# Altium project HNS-ZB206B-0B.PrjPCB
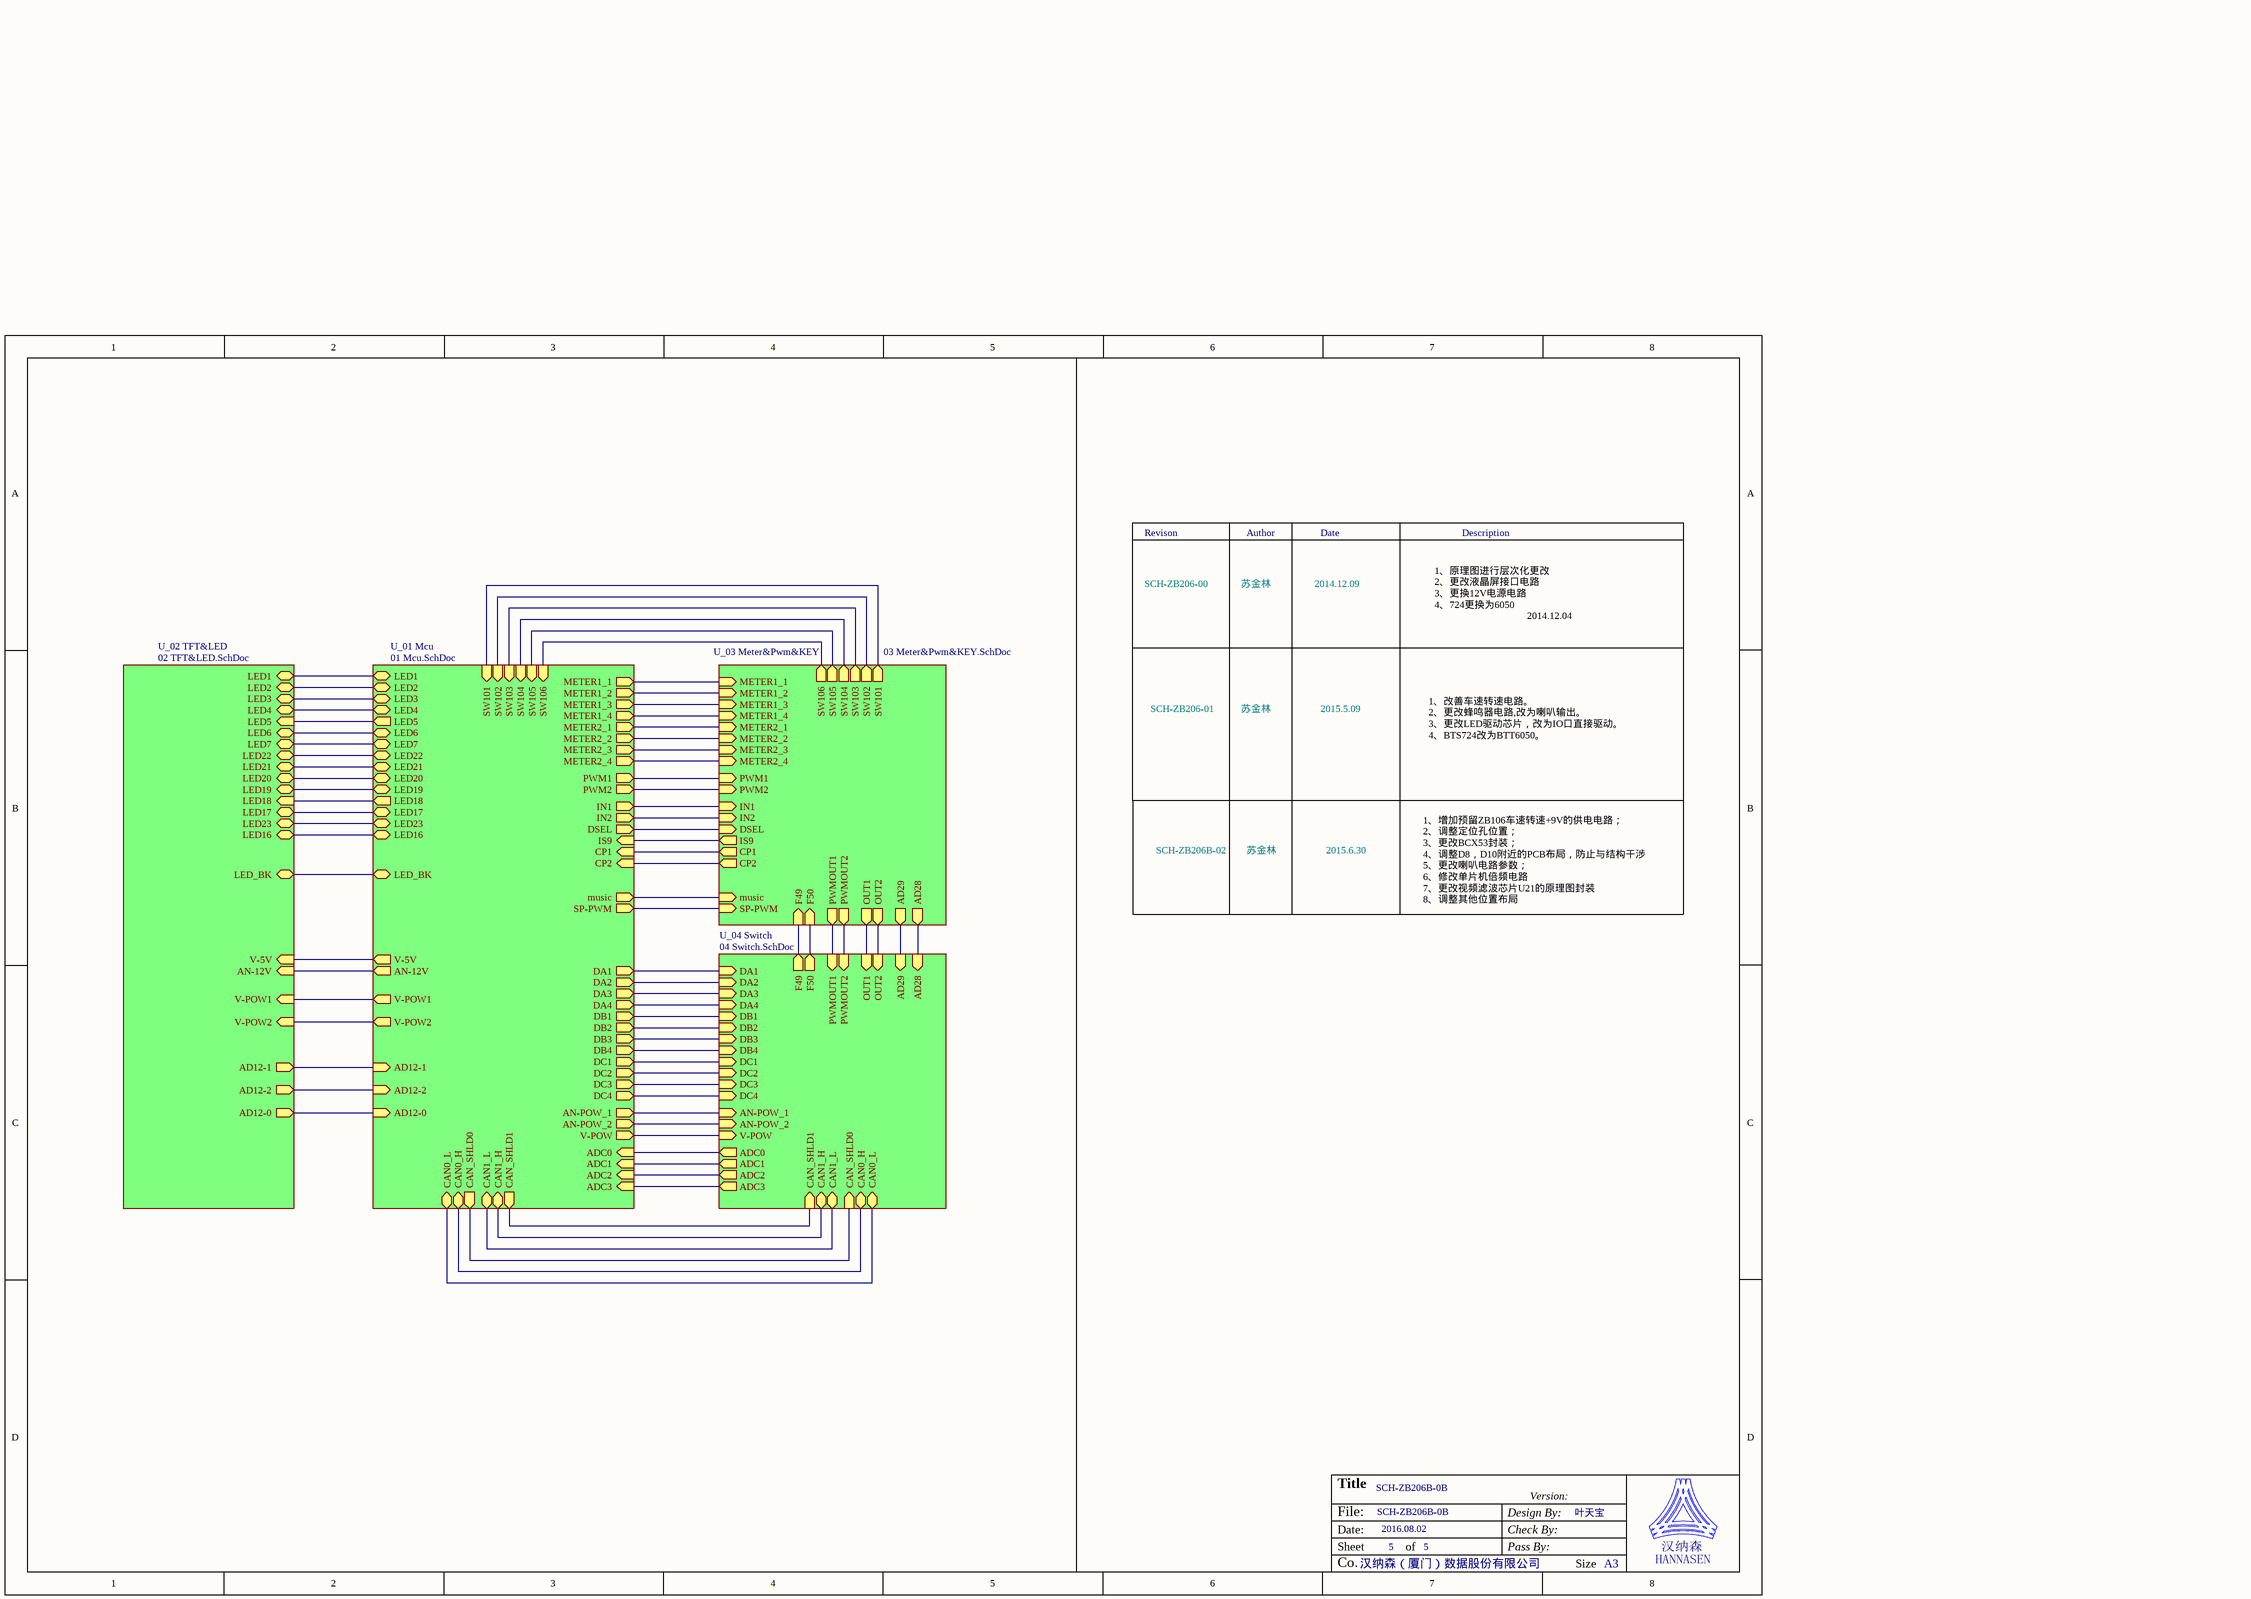
[diagram p0: SCH-ZB206B-0B.SchDoc]
DrawnBy: 叶天宝
3 sheets, 285 parts. Net scope: hierarchical (ports join the sheet entries above them; power ports are global).
Board file: PCB-ZB206B-0B.PcbDoc
Sheets:
  SCH-ZB206B-0B.SchDoc
    U_04 Switch = 04 Switch.SchDoc
    U_01 Mcu = 01 Mcu.SchDoc

## Sheet SCH-ZB206B-0B.SchDoc: Title
size A3; PageSetup: Record=PageOptions|CenterHorizontal=True|CenterVertical=True|PrintScale=1.00|XCorrection=1.00|YCorrection=1.00|PrintKind=0|BorderSize=5000000|LeftOffset=0|BottomOffset=0|Orientation=2|PaperLength=1000|PaperWidth=1000|Scale=100|PaperSource=7|PrintQuality=-4|MediaType=1|DitherType=10|PaperKind=A4|PrintScaleMode=1; ApprovedBy: Approve; CheckedBy: Check; DrawnBy: 叶天宝; Organization: HNS; DocumentNumber: 5; SheetNumber: 5; SheetTotal: 5

### Sub-sheets
U_01 Mcu = 01 Mcu.SchDoc: METER1_1 (out), METER1_2 (out), METER1_3 (out), METER1_4 (out), METER2_1 (out), METER2_2 (out), METER2_3 (out), METER2_4 (out), SW101 (in), SW102 (in), SW103 (in), SW104 (in), SW105 (in), SW106 (in), CP1 (in), CP2 (in), DA1 (out), DA2 (out), DA3 (out), DA4 (out), DB1 (out), DB2 (out), DB3 (out), DB4 (out), DC1 (out), DC2 (out), DC3 (out), DC4 (out), ADC0 (in), ADC1 (in), ADC2 (in), ADC3 (in), PWM1 (out), PWM2 (out), V-POW (out), AN-POW_1 (out), V-5V (out), IN1 (out), IN2 (out), V-POW1 (out), AN-12V (out), LED6 (bidir), LED7 (bidir), LED1 (bidir), LED2 (bidir), LED3 (bidir), LED4 (bidir), LED5 (out), CAN_SHLD1 (out), CAN1_H (bidir), CAN1_L (bidir), CAN_SHLD0 (out), CAN0_H (bidir), CAN0_L (bidir), V-POW2 (out), AD12-1 (in), AD12-2 (in), IS9 (in), DSEL (out), AN-POW_2 (out), music (out), SP-PWM (out), LED17 (bidir), LED22 (bidir), LED21 (bidir), LED20 (bidir), LED19 (bidir), LED18 (out), LED_BK (bidir), LED23 (bidir), LED16 (bidir), AD12-0 (in)
U_02 TFT&LED = 02 TFT&LED.SchDoc (file not in this document): V-5V (in), AD12-0 (out), AN-12V (in), LED2 (bidir), LED1 (bidir), LED3 (bidir), LED4 (bidir), LED5 (in), LED6 (bidir), LED7 (bidir), V-POW1 (in), AD12-1 (out), AD12-2 (out), V-POW2 (in), LED21 (bidir), LED22 (bidir), LED20 (bidir), LED19 (bidir), LED18 (in), LED17 (bidir), LED_BK (bidir), LED23 (bidir), LED16 (bidir)
U_03 Meter&Pwm&KEY = 03 Meter&Pwm&KEY.SchDoc (file not in this document): PWM1 (in), PWMOUT1 (out), PWM2 (in), PWMOUT2 (out), METER1_1 (in), METER1_2 (in), METER1_3 (in), METER1_4 (in), METER2_1 (in), METER2_2 (in), METER2_3 (in), METER2_4 (in), CP1 (out), CP2 (out), F50 (in), F49 (in), OUT1 (out), OUT2 (out), IN1 (in), IN2 (in), SW101 (out), SW102 (out), SW103 (out), SW104 (out), SW105 (out), SW106 (out), DSEL (in), IS9 (out), SP-PWM (in), music (in), AD29 (out), AD28 (out)
U_04 Switch = 04 Switch.SchDoc: F49 (out), F50 (out), PWMOUT1 (in), PWMOUT2 (in), CAN0_H (bidir), CAN_SHLD0 (in), CAN0_L (bidir), CAN1_L (bidir), CAN1_H (bidir), CAN_SHLD1 (in), ADC0 (out), ADC1 (out), ADC2 (out), ADC3 (out), DA1 (in), DA2 (in), DA3 (in), DA4 (in), DB1 (in), DB2 (in), DB3 (in), DB4 (in), DC1 (in), DC2 (in), DC3 (in), DC4 (in), AN-POW_1 (in), OUT1 (in), OUT2 (in), V-POW (in), AD29 (in), AN-POW_2 (in), AD28 (in)

### Nets
AD12-0: sheet U_01 Mcu/AD12-0, sheet U_02 TFT&LED/AD12-0
AD12-1: sheet U_01 Mcu/AD12-1, sheet U_02 TFT&LED/AD12-1
AD12-2: sheet U_01 Mcu/AD12-2, sheet U_02 TFT&LED/AD12-2
AD28: sheet U_04 Switch/AD28, sheet U_03 Meter&Pwm&KEY/AD28
AD29: sheet U_04 Switch/AD29, sheet U_03 Meter&Pwm&KEY/AD29
ADC0: sheet U_04 Switch/ADC0, sheet U_01 Mcu/ADC0
ADC1: sheet U_04 Switch/ADC1, sheet U_01 Mcu/ADC1
ADC2: sheet U_04 Switch/ADC2, sheet U_01 Mcu/ADC2
ADC3: sheet U_04 Switch/ADC3, sheet U_01 Mcu/ADC3
AN-12V: sheet U_01 Mcu/AN-12V, sheet U_02 TFT&LED/AN-12V
AN-POW_1: sheet U_04 Switch/AN-POW_1, sheet U_01 Mcu/AN-POW_1
AN-POW_2: sheet U_04 Switch/AN-POW_2, sheet U_01 Mcu/AN-POW_2
CAN0_H: sheet U_04 Switch/CAN0_H, sheet U_01 Mcu/CAN0_H
CAN0_L: sheet U_04 Switch/CAN0_L, sheet U_01 Mcu/CAN0_L
CAN1_H: sheet U_04 Switch/CAN1_H, sheet U_01 Mcu/CAN1_H
CAN1_L: sheet U_04 Switch/CAN1_L, sheet U_01 Mcu/CAN1_L
CAN_SHLD0: sheet U_04 Switch/CAN_SHLD0, sheet U_01 Mcu/CAN_SHLD0
CAN_SHLD1: sheet U_04 Switch/CAN_SHLD1, sheet U_01 Mcu/CAN_SHLD1
CP1: sheet U_01 Mcu/CP1, sheet U_03 Meter&Pwm&KEY/CP1
CP2: sheet U_01 Mcu/CP2, sheet U_03 Meter&Pwm&KEY/CP2
DA1: sheet U_04 Switch/DA1, sheet U_01 Mcu/DA1
DA2: sheet U_04 Switch/DA2, sheet U_01 Mcu/DA2
DA3: sheet U_04 Switch/DA3, sheet U_01 Mcu/DA3
DA4: sheet U_04 Switch/DA4, sheet U_01 Mcu/DA4
DB1: sheet U_04 Switch/DB1, sheet U_01 Mcu/DB1
DB2: sheet U_04 Switch/DB2, sheet U_01 Mcu/DB2
DB3: sheet U_04 Switch/DB3, sheet U_01 Mcu/DB3
DB4: sheet U_04 Switch/DB4, sheet U_01 Mcu/DB4
DC1: sheet U_04 Switch/DC1, sheet U_01 Mcu/DC1
DC2: sheet U_04 Switch/DC2, sheet U_01 Mcu/DC2
DC3: sheet U_04 Switch/DC3, sheet U_01 Mcu/DC3
DC4: sheet U_04 Switch/DC4, sheet U_01 Mcu/DC4
DSEL: sheet U_01 Mcu/DSEL, sheet U_03 Meter&Pwm&KEY/DSEL
F49: sheet U_04 Switch/F49, sheet U_03 Meter&Pwm&KEY/F49
F50: sheet U_04 Switch/F50, sheet U_03 Meter&Pwm&KEY/F50
IN1: sheet U_01 Mcu/IN1, sheet U_03 Meter&Pwm&KEY/IN1
IN2: sheet U_01 Mcu/IN2, sheet U_03 Meter&Pwm&KEY/IN2
IS9: sheet U_01 Mcu/IS9, sheet U_03 Meter&Pwm&KEY/IS9
LED1: sheet U_01 Mcu/LED1, sheet U_02 TFT&LED/LED1
LED2: sheet U_01 Mcu/LED2, sheet U_02 TFT&LED/LED2
LED3: sheet U_01 Mcu/LED3, sheet U_02 TFT&LED/LED3
LED4: sheet U_01 Mcu/LED4, sheet U_02 TFT&LED/LED4
LED5: sheet U_01 Mcu/LED5, sheet U_02 TFT&LED/LED5
LED6: sheet U_01 Mcu/LED6, sheet U_02 TFT&LED/LED6
LED7: sheet U_01 Mcu/LED7, sheet U_02 TFT&LED/LED7
LED16: sheet U_01 Mcu/LED16, sheet U_02 TFT&LED/LED16
LED17: sheet U_01 Mcu/LED17, sheet U_02 TFT&LED/LED17
LED18: sheet U_01 Mcu/LED18, sheet U_02 TFT&LED/LED18
LED19: sheet U_01 Mcu/LED19, sheet U_02 TFT&LED/LED19
LED20: sheet U_01 Mcu/LED20, sheet U_02 TFT&LED/LED20
LED21: sheet U_01 Mcu/LED21, sheet U_02 TFT&LED/LED21
LED22: sheet U_01 Mcu/LED22, sheet U_02 TFT&LED/LED22
LED23: sheet U_01 Mcu/LED23, sheet U_02 TFT&LED/LED23
LED_BK: sheet U_01 Mcu/LED_BK, sheet U_02 TFT&LED/LED_BK
METER1_1: sheet U_01 Mcu/METER1_1, sheet U_03 Meter&Pwm&KEY/METER1_1
METER1_2: sheet U_01 Mcu/METER1_2, sheet U_03 Meter&Pwm&KEY/METER1_2
METER1_3: sheet U_01 Mcu/METER1_3, sheet U_03 Meter&Pwm&KEY/METER1_3
METER1_4: sheet U_01 Mcu/METER1_4, sheet U_03 Meter&Pwm&KEY/METER1_4
METER2_1: sheet U_01 Mcu/METER2_1, sheet U_03 Meter&Pwm&KEY/METER2_1
METER2_2: sheet U_01 Mcu/METER2_2, sheet U_03 Meter&Pwm&KEY/METER2_2
METER2_3: sheet U_01 Mcu/METER2_3, sheet U_03 Meter&Pwm&KEY/METER2_3
METER2_4: sheet U_01 Mcu/METER2_4, sheet U_03 Meter&Pwm&KEY/METER2_4
music: sheet U_01 Mcu/music, sheet U_03 Meter&Pwm&KEY/music
OUT1: sheet U_04 Switch/OUT1, sheet U_03 Meter&Pwm&KEY/OUT1
OUT2: sheet U_04 Switch/OUT2, sheet U_03 Meter&Pwm&KEY/OUT2
PWM1: sheet U_01 Mcu/PWM1, sheet U_03 Meter&Pwm&KEY/PWM1
PWM2: sheet U_01 Mcu/PWM2, sheet U_03 Meter&Pwm&KEY/PWM2
PWMOUT1: sheet U_04 Switch/PWMOUT1, sheet U_03 Meter&Pwm&KEY/PWMOUT1
PWMOUT2: sheet U_04 Switch/PWMOUT2, sheet U_03 Meter&Pwm&KEY/PWMOUT2
SP-PWM: sheet U_01 Mcu/SP-PWM, sheet U_03 Meter&Pwm&KEY/SP-PWM
SW101: sheet U_01 Mcu/SW101, sheet U_03 Meter&Pwm&KEY/SW101
SW102: sheet U_01 Mcu/SW102, sheet U_03 Meter&Pwm&KEY/SW102
SW103: sheet U_01 Mcu/SW103, sheet U_03 Meter&Pwm&KEY/SW103
SW104: sheet U_01 Mcu/SW104, sheet U_03 Meter&Pwm&KEY/SW104
SW105: sheet U_01 Mcu/SW105, sheet U_03 Meter&Pwm&KEY/SW105
SW106: sheet U_01 Mcu/SW106, sheet U_03 Meter&Pwm&KEY/SW106
V-5V: sheet U_01 Mcu/V-5V, sheet U_02 TFT&LED/V-5V
V-POW: sheet U_04 Switch/V-POW, sheet U_01 Mcu/V-POW
V-POW1: sheet U_01 Mcu/V-POW1, sheet U_02 TFT&LED/V-POW1
V-POW2: sheet U_01 Mcu/V-POW2, sheet U_02 TFT&LED/V-POW2

### Notes on the sheet
- Revison
- Author
- Date
- Description
- SCH-ZB206-00
- 苏金林
- 2014.12.09
- 1、原理图进行层次化更改
  2、更改液晶屏接口电路
  3、更换12V电源电路
  4、724更换为6050
  2014.12.04
- SCH-ZB206-01
- 2015.5.09
- 1、改善车速转速电路。
  2、更改蜂鸣器电路,改为喇叭输出。
  3、更改LED驱动芯片，改为IO口直接驱动。
  4、BTS724改为BTT6050。
- SCH-ZB206B-02
- 2015.6.30
- 1、增加预留ZB106车速转速+9V的供电电路；
  2、调整定位孔位置；
  3、更改BCX53封装；
  4、调整D8，D10附近的PCB布局，防止与结构干涉
  5、更改喇叭电路参数；
  6、修改单片机倍频电路
  7、更改视频滤波芯片U21的原理图封装
  8、调整其他位置布局
- SCH-ZB206B-0B
- 2016.08.02
- 5
- 叶天宝
- Title
- Version:
- File:
- Date:
- Sheet
- of
- Design By:
- Check By:
- Pass By:
- Co.
- 汉纳森（厦门）数据股份有限公司
- Size
- A3

## Sheet 04 Switch.SchDoc: Title
size A3; ApprovedBy: Approve; CheckedBy: Check; DrawnBy: 叶天宝; Organization: HNS; DocumentNumber: 4; SheetNumber: 4; SheetTotal: 5
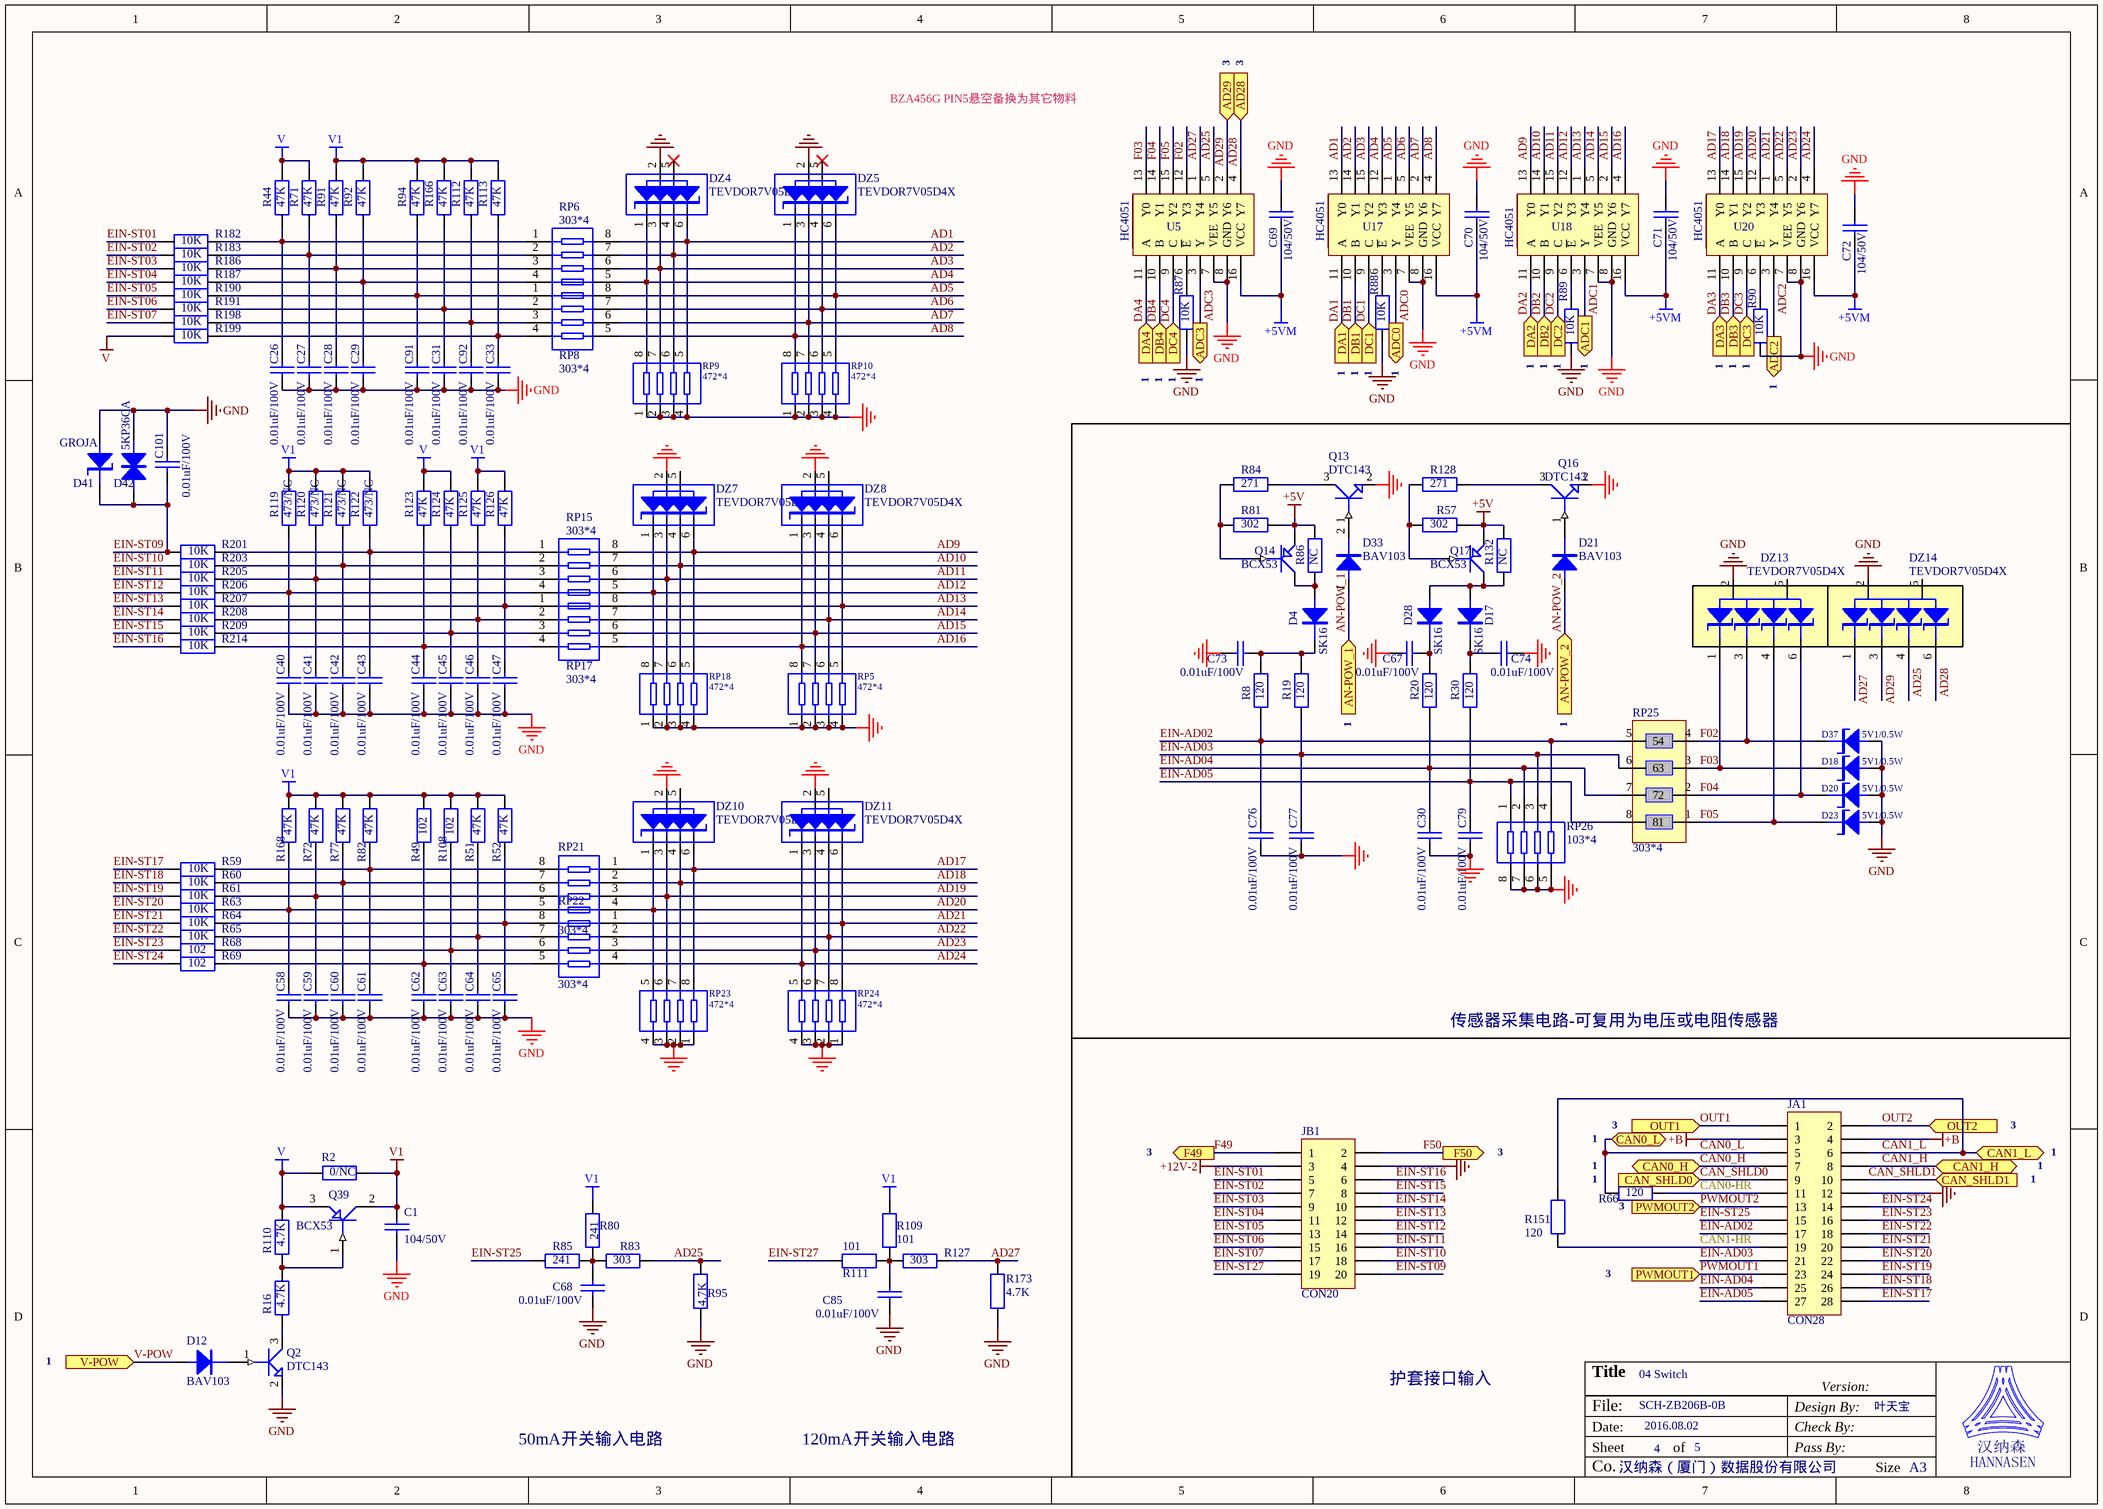
[diagram p1: 04 Switch.SchDoc]

### Parts
C1  104/50V  [CR0805]
C26  0.01uF/100V  [CR0805]
C27  0.01uF/100V  [CR0805]
C28  0.01uF/100V  [CR0805]
C29  0.01uF/100V  [CR0805]
C30  0.01uF/100V  [CR0805]
C31  0.01uF/100V  [CR0805]
C33  0.01uF/100V  [CR0805]
C40  0.01uF/100V  [CR0805]
C41  0.01uF/100V  [CR0805]
C42  0.01uF/100V  [CR0805]
C43  0.01uF/100V  [CR0805]
C44  0.01uF/100V  [CR0805]
C45  0.01uF/100V  [CR0805]
C46  0.01uF/100V  [CR0805]
C47  0.01uF/100V  [CR0805]
C58  0.01uF/100V  [CR0805]
C59  0.01uF/100V  [CR0805]
C60  0.01uF/100V  [CR0805]
C61  0.01uF/100V  [CR0805]
C62  0.01uF/100V  [CR0805]
C63  0.01uF/100V  [CR0805]
C64  0.01uF/100V  [CR0805]
C65  0.01uF/100V  [CR0805]
C67  0.01uF/100V  [CR0805]
C68  0.01uF/100V  [CR0805]
C69  104/50V  [CR0805]
C70  104/50V  [CR0805]
C71  104/50V  [CR0805]
C72  104/50V  [CR0805]
C73  0.01uF/100V  [CR0805]
C74  0.01uF/100V  [CR0805]
C76  0.01uF/100V  [CR0805]
C77  0.01uF/100V  [CR0805]
C79  0.01uF/100V  [CR0805]
C85  0.01uF/100V  [CR0805]
C91  0.01uF/100V  [CR0805]
C92  0.01uF/100V  [CR0805]
C101  0.01uF/100V  [CR0805]
D4  SK16  [SMA]
D12  BAV103  [SOD-80C]
D17  SK16  [SMA]
D18  5V1/0.5W  [SOD-80C]
D20  5V1/0.5W  [SOD-80C]
D21  BAV103  [SOD-80C]
D23  5V1/0.5W  [SOD-80C]
D28  SK16  [SMA]
D33  BAV103  [SOD-80C]
D37  5V1/0.5W  [SOD-80C]
D41  GROJA  [SMA]
D42  5KP36CA  [SMB-D]
DZ4  TEVDOR7V05D4X  [SOT-457]
DZ5  TEVDOR7V05D4X  [SOT-457]
DZ7  TEVDOR7V05D4X  [SOT-457]
DZ8  TEVDOR7V05D4X  [SOT-457]
DZ10  TEVDOR7V05D4X  [SOT-457]
DZ11  TEVDOR7V05D4X  [SOT-457]
DZ13  TEVDOR7V05D4X  [SOT-457]
DZ14  TEVDOR7V05D4X  [SOT-457]
JA1  CON28  [AMP DIP28]
JB1  CON20  [AMP DIP20]
Q2  DTC143  [SOT23]
Q13  DTC143  [SOT23]
Q14  BCX53  [SOT89]
Q16  DTC143  [SOT23]
Q17  BCX53  [SOT89]
Q39  BCX53  [SOT89]
R2  0/NC  [CR1206]
R8  120  [CR1206]
R16  4.7K  [CR1206]
R19  120  [CR1206]
R20  120  [CR1206]
R30  120  [CR1206]
R44  47K  [CR0805]
R49  102  [CR2010]
R51  47K  [CR0805]
R52  47K  [CR0805]
R57  302  [CR0805]
R59  10K  [CR1206]
R60  10K  [CR1206]
R61  10K  [CR1206]
R63  10K  [CR1206]
R64  10K  [CR1206]
R65  10K  [CR1206]
R66  120  [CR0805]
R68  102  [CR2010]
R69  102  [CR2010]
R71  47K  [CR0805]
R72  47K  [CR0805]
R77  47K  [CR0805]
R80  241  [R-3W]
R81  302  [CR0805]
R82  47K  [CR0805]
R83  303  [CR0805]
R84  271  [CR0805]
R85  241  [R-3W]
R86  NC  [CR1206]
R87  10K  [CR0805]
R88  10K  [CR0805]
R89  10K  [CR0805]
R90  10K  [CR0805]
R91  47K  [CR0805]
R92  47K  [CR0805]
R94  47K  [CR0805]
R95  4.7K  [CR0805]
R108  102  [CR2010]
R109  101  [R-3W]
R110  4.7K  [CR0805]
R111  101  [R-3W]
R112  47K  [CR0805]
R113  47K  [CR0805]
R119  473/NC  [CR0805]
R120  473/NC  [CR0805]
R121  473/NC  [CR0805]
R122  473/NC  [CR0805]
R123  47K  [CR0805]
R124  47K  [CR0805]
R125  47K  [CR0805]
R126  47K  [CR0805]
R127  303  [CR0805]
R128  271  [CR0805]
R132  NC  [CR1206]
R151  120  [CR0805]
R166  47K  [CR0805]
R168  47K  [CR0805]
R173  4.7K  [CR0805]
R182  10K  [CR1206]
R183  10K  [CR1206]
R186  10K  [CR1206]
R187  10K  [CR1206]
R190  10K  [CR1206]
R191  10K  [CR1206]
R198  10K  [CR1206]
R199  10K  [CR1206]
R201  10K  [CR1206]
R203  10K  [CR1206]
R205  10K  [CR1206]
R206  10K  [CR1206]
R207  10K  [CR1206]
R208  10K  [CR1206]
R209  10K  [CR1206]
R214  10K  [CR1206]
RP5  472*4  [R4]
RP6  303*4  [R4]
RP8  303*4  [R4]
RP9  472*4  [R4]
RP10  472*4  [R4]
RP15  303*4  [R4]
RP17  303*4  [R4]
RP18  472*4  [R4]
RP21  303*4  [R4]
RP22  303*4  [R4]
RP23  472*4  [R4]
RP24  472*4  [R4]
RP25  303*4  [R4]
RP26  103*4  [R4]
U5  HC4051  [SO-16]
U17  HC4051  [SO-16]
U18  HC4051  [SO-16]
U20  HC4051  [SO-16]

### Ports
AD28 (in), AD29 (in), ADC0 (out), ADC1 (out), ADC2 (out), ADC3 (out), AN-POW_1 (in), AN-POW_2 (in), CAN0_H (bidir), CAN0_L (bidir), CAN1_H (bidir), CAN1_L (bidir), CAN_SHLD0 (in), CAN_SHLD1 (in), DA1 (in), DA2 (in), DA3 (in), DA4 (in), DB1 (in), DB2 (in), DB3 (in), DB4 (in), DC1 (in), DC2 (in), DC3 (in), DC4 (in), F49 (out), F50 (out), OUT1 (in), OUT2 (in), PWMOUT1 (in), PWMOUT2 (in), V-POW (in)

### Nets
+5V: Q14.3(E) Q17.3(E) R57.1 R81.1 R86.1 R132.1
+5VM: C69.2 C70.2 C71.2 C72.2 U5.16(VCC) U17.16(VCC) U18.16(VCC) U20.16(VCC)
+12V-2: JB1.3
+B: JA1.3 JA1.4
GND: C1.2 C26.2 C27.2 C28.2 C29.2 C30.2 C31.2 C33.2 C40.2 C41.2 C42.2 C43.2 C44.2 C45.2 C46.2 C47.2 C58.2 C59.2 C60.2 C61.2 C62.2 C63.2 C64.2 C65.2 C67.1 C68.2 C69.1 C70.1 C71.1 C72.1 C73.1 C74.2 C76.2 C77.2 C79.2 C85.2 C91.2 C92.2 C101.1 D18.1(A) D20.1(A) D23.1(A) D37.1(A) D41.1(A) D42.1 DZ4.2 DZ5.2 DZ7.2 DZ8.2 DZ10.2 DZ11.2 DZ13.2 DZ14.2 JA1.12 JB1.4 Q2.2(gnd) Q13.2(gnd) Q16.2(gnd) R87.2 R88.2 R89.2 R90.2 R95.1 R173.1 RP5.1 RP5.2 RP5.3 RP5.4 RP9.1 RP9.2 RP9.3 RP9.4 RP10.1 RP10.2 RP10.3 RP10.4 RP18.1 RP18.2 RP18.3 RP18.4 RP23.1 RP23.2 RP23.3 RP23.4 RP24.1 RP24.2 RP24.3 RP24.4 RP26.5 RP26.6 RP26.7 RP26.8 U5.7(VEE) U5.8(GND) U17.7(VEE) U17.8(GND) U18.7(VEE) U18.8(GND) U20.7(VEE) U20.8(GND)
V: Q39.3(C) R2.1 R44.2 R71.2 R110.2 R123.2 R124.2 R199.1
V1: C1.1 Q39.2(E) R2.2 R49.2 R51.2 R52.2 R72.2 R77.2 R80.2 R82.2 R91.2 R92.2 R94.2 R108.2 R109.2 R112.2 R113.2 R119.2 R120.2 R121.2 R122.2 R125.2 R126.2 R166.2 R168.2
AD1: DZ4.6 RP6.8 RP9.5 U17.13(Y0)
AD2: DZ4.4 RP6.7 RP9.6 U17.14(Y1)
AD3: DZ4.3 RP6.6 RP9.7 U17.15(Y2)
AD4: DZ4.1 RP6.5 RP9.8 U17.12(Y3)
AD5: DZ5.6 RP8.8 RP10.5 U17.1(Y4)
AD6: DZ5.4 RP8.7 RP10.6 U17.5(Y5)
AD7: DZ5.3 RP8.6 RP10.7 U17.2(Y6)
AD8: DZ5.1 RP8.5 RP10.8 U17.4(Y7)
AD9: DZ7.6 RP15.8 RP18.5 U18.13(Y0)
AD10: DZ7.4 RP15.7 RP18.6 U18.14(Y1)
AD11: DZ7.3 RP15.6 RP18.7 U18.15(Y2)
AD12: DZ7.1 RP15.5 RP18.8 U18.12(Y3)
AD13: DZ8.6 RP5.5 RP17.8 U18.1(Y4)
AD14: DZ8.4 RP5.6 RP17.7 U18.5(Y5)
AD15: DZ8.3 RP5.7 RP17.6 U18.2(Y6)
AD16: DZ8.1 RP5.8 RP17.5 U18.4(Y7)
AD17: DZ10.6 RP21.1 RP23.8 U20.13(Y0)
AD18: DZ10.4 RP21.2 RP23.7 U20.14(Y1)
AD19: DZ10.3 RP21.3 RP23.6 U20.15(Y2)
AD20: DZ10.1 RP21.4 RP23.5 U20.12(Y3)
AD21: DZ11.6 RP22.1 RP24.8 U20.1(Y4)
AD22: DZ11.4 RP22.2 RP24.7 U20.5(Y5)
AD23: DZ11.3 RP22.3 RP24.6 U20.2(Y6)
AD24: DZ11.1 RP22.4 RP24.5 U20.4(Y7)
AD25: DZ14.4 R83.2 R95.2 U5.5(Y5)
AD27: DZ14.1 R127.2 R173.2 U5.1(Y4)
AD28: DZ14.6 U5.4(Y7) ; port AD28
AD29: DZ14.3 U5.2(Y6) ; port AD29
ADC0: U17.3(Y) ; port ADC0
ADC1: U18.3(Y) ; port ADC1
ADC2: U20.3(Y) ; port ADC2
ADC3: U5.3(Y) ; port ADC3
AN-POW_1: D33.1(A) ; port AN-POW_1
AN-POW_2: D21.1(A) ; port AN-POW_2
CAN0-HR: JA1.11 R66.2
CAN0_H: JA1.7 ; port CAN0_H
CAN0_L: JA1.5 R66.1 ; port CAN0_L
CAN1-HR: JA1.19 R151.1
CAN1_H: JA1.8 ; port CAN1_H
CAN1_L: JA1.6 R151.2 ; port CAN1_L
CAN_SHLD0: JA1.9 ; port CAN_SHLD0
CAN_SHLD1: JA1.10 ; port CAN_SHLD1
DA1: U17.11(A) ; port DA1
DA2: U18.11(A) ; port DA2
DA3: U20.11(A) ; port DA3
DA4: U5.11(A) ; port DA4
DB1: U17.10(B) ; port DB1
DB2: U18.10(B) ; port DB2
DB3: U20.10(B) ; port DB3
DB4: U5.10(B) ; port DB4
DC1: U17.9(C) ; port DC1
DC2: U18.9(C) ; port DC2
DC3: U20.9(C) ; port DC3
DC4: U5.9(C) ; port DC4
EIN-AD02: C76.1 JA1.17 R8.2 RP25.5 RP26.4
EIN-AD03: C77.1 JA1.21 R19.2 RP25.6 RP26.3
EIN-AD04: C30.1 JA1.25 R20.2 RP25.7 RP26.2
EIN-AD05: C79.1 JA1.27 R30.2 RP25.8 RP26.1
EIN-ST01: JB1.5 R182.1
EIN-ST02: JB1.7 R183.1
EIN-ST03: JB1.9 R186.1
EIN-ST04: JB1.11 R187.1
EIN-ST05: JB1.13 R190.1
EIN-ST06: JB1.15 R191.1
EIN-ST07: JB1.17 R198.1
EIN-ST09: C101.2 D41.2(K) D42.2 JB1.20 R201.1
EIN-ST10: JB1.18 R203.1
EIN-ST11: JB1.16 R205.1
EIN-ST12: JB1.14 R206.1
EIN-ST13: JB1.12 R207.1
EIN-ST14: JB1.10 R208.1
EIN-ST15: JB1.8 R209.1
EIN-ST16: JB1.6 R214.1
EIN-ST17: JA1.28 R59.1
EIN-ST18: JA1.26 R60.1
EIN-ST19: JA1.24 R61.1
EIN-ST20: JA1.22 R63.1
EIN-ST21: JA1.20 R64.1
EIN-ST22: JA1.18 R65.1
EIN-ST23: JA1.16 R68.1
EIN-ST24: JA1.14 R69.1
EIN-ST25: JA1.15 R85.1
EIN-ST27: JB1.19 R111.1
F02: D37.2(K) DZ13.3 RP25.4 U5.12(Y3)
F03: D18.2(K) DZ13.1 RP25.3 U5.13(Y0)
F04: D20.2(K) DZ13.6 RP25.2 U5.14(Y1)
F05: D23.2(K) DZ13.4 RP25.1 U5.15(Y2)
F49: JB1.1 ; port F49
F50: JB1.2 ; port F50
OUT1: JA1.1 ; port OUT1
OUT2: JA1.2 ; port OUT2
PWMOUT1: JA1.23 ; port PWMOUT1
PWMOUT2: JA1.13 ; port PWMOUT2
V-POW: D12.1(A) ; port V-POW
NetC26_1: C26.1 R44.1 R182.2 RP6.1
NetC27_1: C27.1 R71.1 R183.2 RP6.2
NetC28_1: C28.1 R91.1 R186.2 RP6.3
NetC29_1: C29.1 R92.1 R187.2 RP6.4
NetC31_1: C31.1 R166.1 R191.2 RP8.2
NetC33_1: C33.1 R113.1 R199.2 RP8.4
NetC40_1: C40.1 R119.1 R206.2 RP15.4
NetC41_1: C41.1 R120.1 R205.2 RP15.3
NetC42_1: C42.1 R121.1 R203.2 RP15.2
NetC43_1: C43.1 R122.1 R201.2 RP15.1
NetC44_1: C44.1 R123.1 R214.2 RP17.4
NetC45_1: C45.1 R124.1 R209.2 RP17.3
NetC46_1: C46.1 R125.1 R208.2 RP17.2
NetC47_1: C47.1 R126.1 R207.2 RP17.1
NetC58_1: C58.1 R63.2 R168.1 RP21.5
NetC59_1: C59.1 R61.2 R72.1 RP21.6
NetC60_1: C60.1 R60.2 R77.1 RP21.7
NetC61_1: C61.1 R59.2 R82.1 RP21.8
NetC62_1: C62.1 R49.1 R69.2 RP22.5
NetC63_1: C63.1 R68.2 R108.1 RP22.6
NetC64_1: C64.1 R51.1 R65.2 RP22.7
NetC65_1: C65.1 R52.1 R64.2 RP22.8
NetC67_2: C67.2 D28.2(K) R20.1
NetC68_1: C68.1 R80.1 R83.1 R85.2
NetC73_2: C73.2 D4.2(K) R8.1 R19.1
NetC74_1: C74.1 D17.2(K) R30.1
NetC85_1: C85.1 R109.1 R111.2 R127.1
NetC91_1: C91.1 R94.1 R190.2 RP8.1
NetC92_1: C92.1 R112.1 R198.2 RP8.3
NetD4_1: D4.1(A) Q14.2(C) R86.2
NetD12_2: D12.2(K) Q2.1(in)
NetD17_1: D17.1(A) D28.1(A) Q17.2(C) R132.2
NetD21_2: D21.2(K) Q16.1(in)
NetD33_2: D33.2(K) Q13.1(in)
NetQ2_3: Q2.3(out) R16.1
NetQ13_3: Q13.3(out) R84.2
NetQ14_1: Q14.1(B) R81.2 R84.1
NetQ16_3: Q16.3(out) R128.1
NetQ17_1: Q17.1(B) R57.2 R128.2
NetQ39_1: Q39.1(B) R16.2 R110.1
NetR87_1: R87.1 U5.6(~{E})
NetR88_1: R88.1 U17.6(~{E})
NetR89_1: R89.1 U18.6(~{E})
NetR90_1: R90.1 U20.6(~{E})

Not connected (* = marked no-connect by the designer): DZ4 5*; DZ5 5*; DZ7 5; DZ8 5; DZ10 5; DZ11 5; DZ13 5; DZ14 5

### Notes on the sheet
- BZA456G PIN5悬空备换为其它物料
- 3
- 1
- (near R87) 1
- (near R88) 1
- (near R89) 1
- (near R90) 1
- (near R19) 1
- 传感器采集电路-可复用为电压或电阻传感器
- (near R66) 3
- 护套接口输入
- 04 Switch
- 50mA开关输入电路
- 120mA开关输入电路
- SCH-ZB206B-0B
- 2016.08.02
- 4
- 5
- 叶天宝
- Title
- Version:
- File:
- Date:
- Sheet
- of
- Design By:
- Check By:
- Pass By:
- Co.
- 汉纳森（厦门）数据股份有限公司
- Size
- A3

### Library data of the parts
C1 = CAP: 贴片电容
C26-C31 C33 C40-C47 C58-C65 C67-C74 C76 C77 C79 C85 C91 C92 C101 = CAP: Capacitor
D4 D12 D17 D21 D28 D33 = DIODE: 二极管
D18 D20 D23 D37 D41 = DW: 稳压二极管
D42 = TVS
DZ4 DZ5 DZ7 DZ8 DZ10 DZ11 DZ13 DZ14 = BZA456G: 二极管排
Q2 Q13 Q16 = DTC143: NPN; HelpURL: G:\资料\规格书\二三极管\dtc143ee.pdf
Q14 Q17 = PNP1: 贴片三极管
Q39 = BSP631: PNP三极管
R2 R8 R16 R19 R20 R30 R44 R49 R51 R52 R57 R59-R61 R63-R66 R68 R69 R71 R72 R77 R80-R92 R94 R95 R108-R113 R119-R128 R132 R151 R166 R168 R173 R182 R183 R186 R187 R190 R191 R198 R199 R201 R203 R205-R209 R214 = RES: 贴片电阻
RP5 RP9 RP10 RP18 RP23 RP24 = RN: 排阻
RP6 RP8 RP15 RP17 RP21 RP22 = R_LINE4: 贴片排阻
RP25 = R_ARRAY
RP26 = R_LINE4: 排阻
U5 U17 U18 U20 = HC4051: IC-8路模拟开关集成快; HelpURL: G:\资料\规格书\数字逻辑\74HC4051.pdf

## Sheet 01 Mcu.SchDoc: SCH-ZB206B-0B
size A3; ApprovedBy: Approve; CheckedBy: Check; DrawnBy: 叶天宝; Organization: HNS; DocumentNumber: 1; SheetNumber: 1; SheetTotal: 5
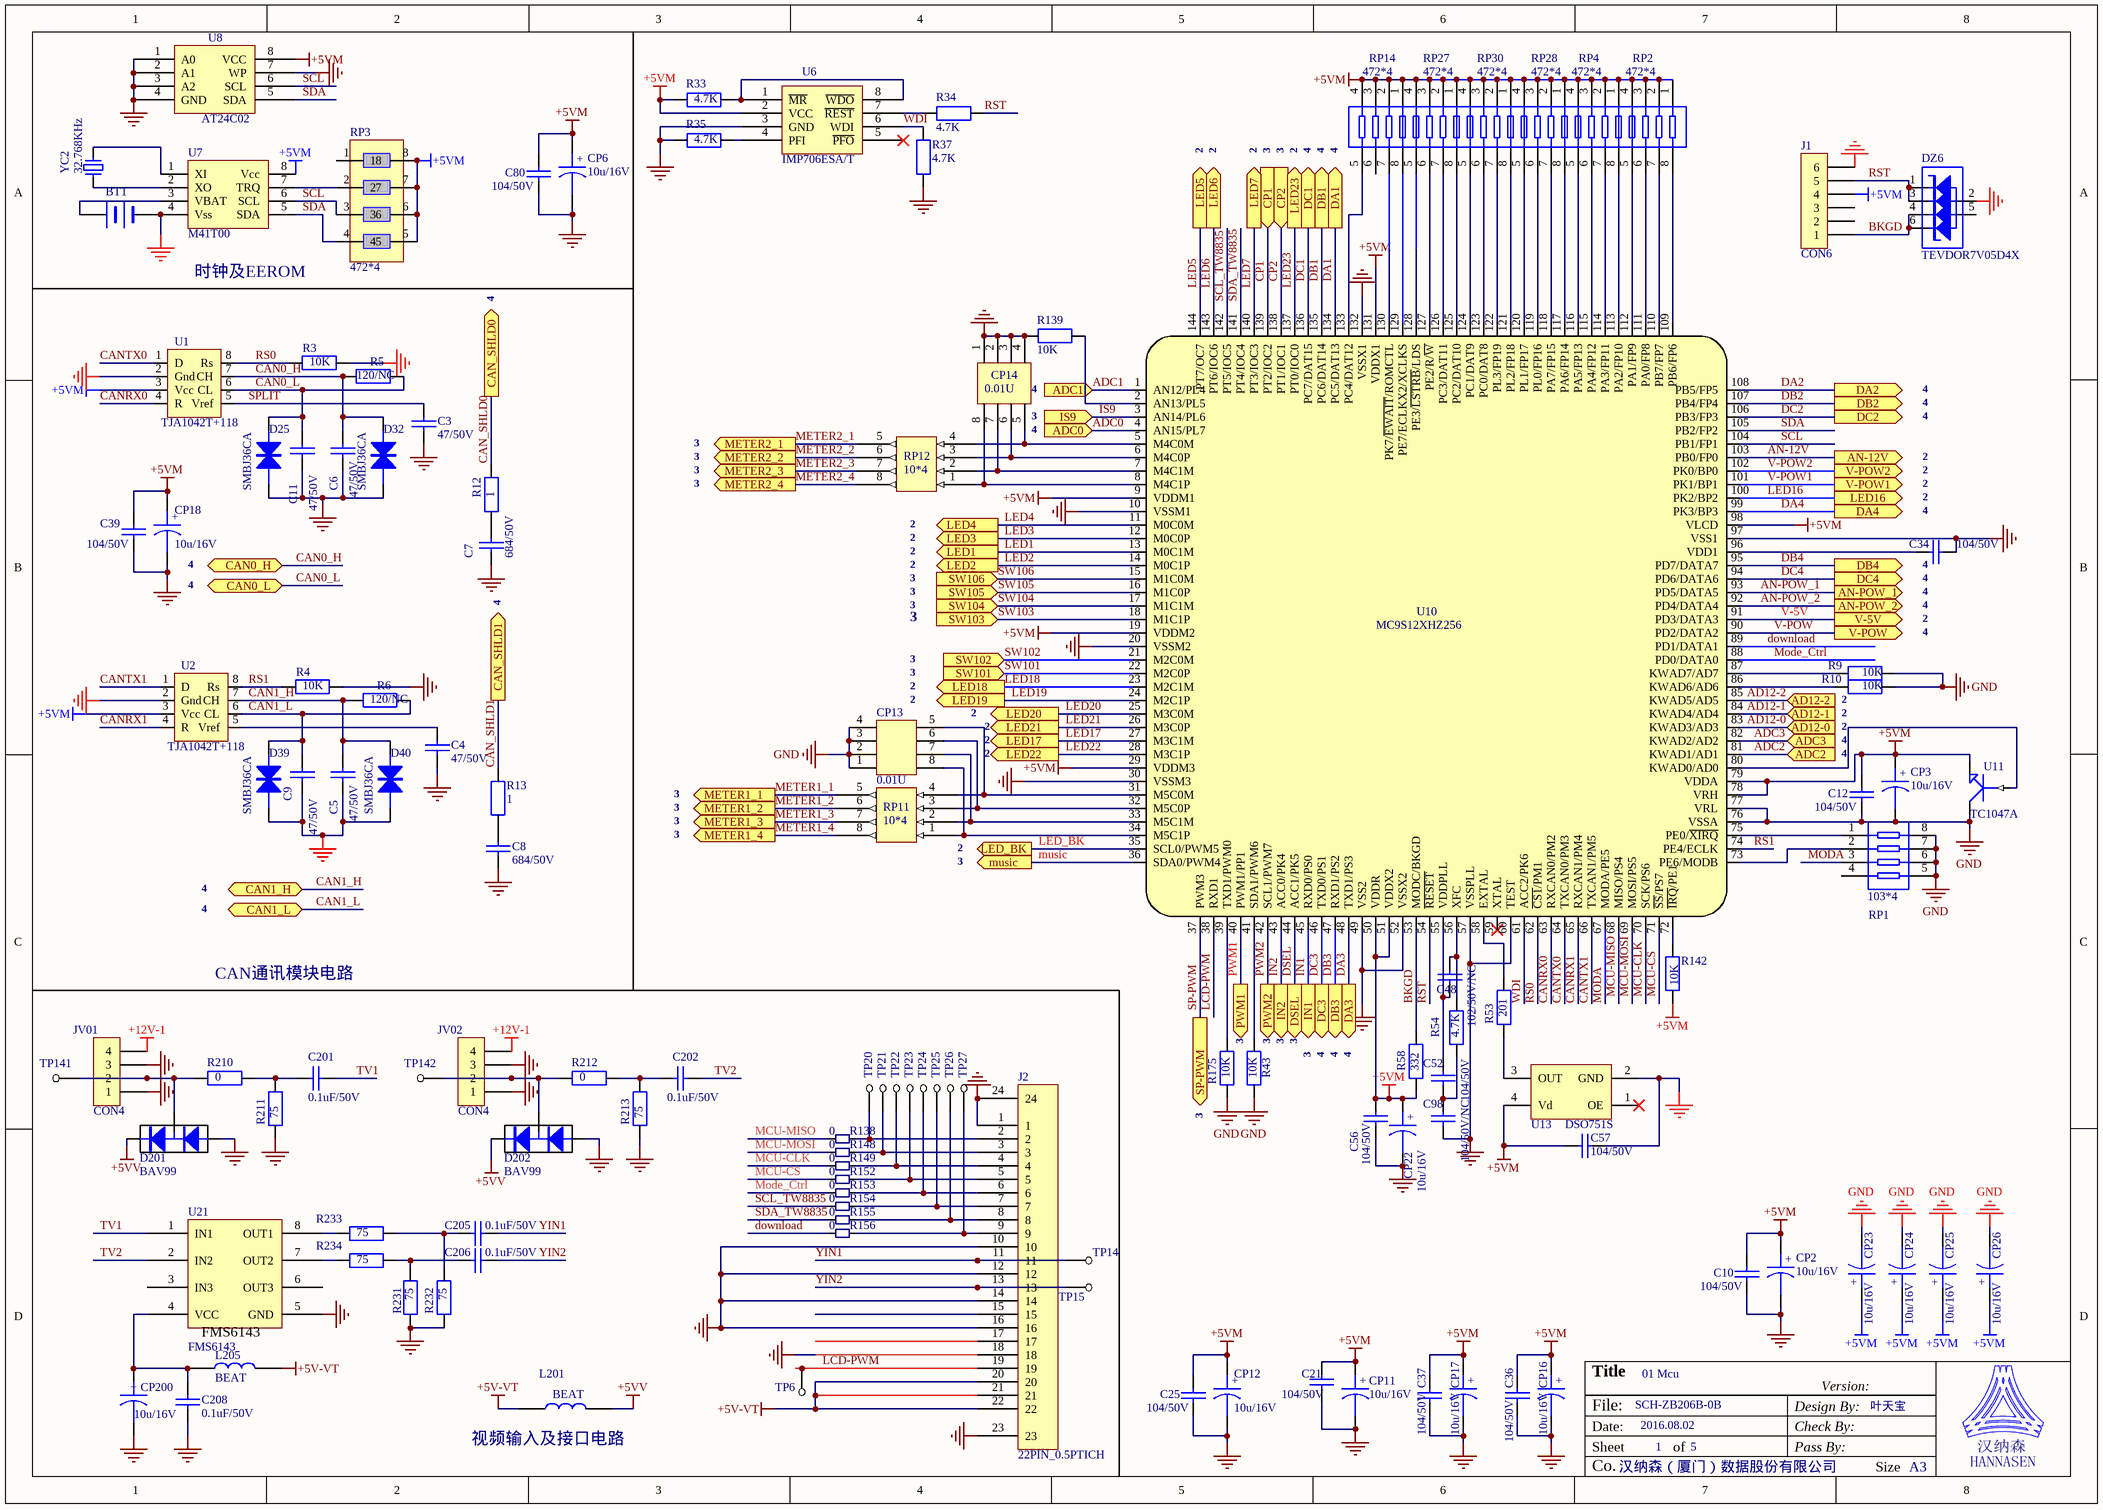
[diagram p2: 01 Mcu.SchDoc]

### Parts
BT1  (no value)  [Battery 3]
C3  47/50V  [CR0805]
C4  47/50V  [CR0805]
C5  47/50V  [CR0805]
C6  47/50V  [CR0805]
C7  684/50V  [CR1206]
C8  684/50V  [CR1206]
C9  47/50V  [CR0805]
C10  104/50V  [CR0805]
C11  47/50V  [CR0805]
C12  104/50V  [CR0805]
C21  104/50V  [CR0805]
C25  104/50V  [CR0805]
C34  104/50V  [CR0805]
C36  104/50V  [CR0805]
C37  104/50V  [CR0805]
C39  104/50V  [CR0805]
C48  102/50V/NC  [CR0805]
C52  104/50V  [CR0805]
C56  104/50V  [CR0805]
C57  104/50V  [CR0805]
C80  104/50V  [CR0805]
C98  104/50V/NC  [CR0805]
C201  0.1uF/50V  [CR0805]
C202  0.1uF/50V  [CR0805]
C205  0.1uF/50V  [CR0805]
C206  0.1uF/50V  [CR0805]
C208  0.1uF/50V  [CR0805]
CP2  10u/16V  [CE1206]
CP3  10u/16V  [CE1206]
CP6  10u/16V  [CE1206]
CP11  10u/16V  [CE1206]
CP12  10u/16V  [CE1206]
CP13  0.01U  [C4]
CP14  0.01U  [C4]
CP16  10u/16V  [CE1206]
CP17  10u/16V  [CE1206]
CP18  10u/16V  [CE1206]
CP22  10u/16V  [CE1206]
CP23  10u/16V  [CE1206]
CP24  10u/16V  [CE1206]
CP25  10u/16V  [CE1206]
CP26  10u/16V  [CE1206]
CP200  10u/16V  [CE1206]
D25  SMBJ36CA  [SMB-D]
D32  SMBJ36CA  [SMB-D]
D39  SMBJ36CA  [SMB-D]
D40  SMBJ36CA  [SMB-D]
D201  BAV99  [SOT23]
D202  BAV99  [SOT23]
DZ6  TEVDOR7V05D4X  [SOT-457]
J1  CON6  [DIP 2X3 2.54mm]
J2  22PIN_0.5PTICH  [FPC-22P]
JV01  CON4  [DIP 1X4 2.5mm]
JV02  CON4  [DIP 1X4 2.5mm]
L201  BEAT  [CR0805]
L205  BEAT  [CR0805]
R3  10K  [CR0805]
R4  10K  [CR0805]
R5  120/NC  [CR0805]
R6  120/NC  [CR0805]
R9  10K  [CR0805]
R10  10K  [CR0805]
R12  1  [CR0805]
R13  1  [CR0805]
R33  4.7K  [CR0805]
R34  4.7K  [CR0805]
R35  4.7K  [CR0805]
R37  4.7K  [CR0805]
R43  10K  [CR0805]
R53  201  [CR0805]
R54  4.7K  [CR0805]
R58  332  [CR0805]
R138  0  [CR0805]
R139  10K  [CR0805]
R142  10K  [cr0805]
R148  0  [CR0805]
R149  0  [CR0805]
R152  0  [CR0805]
R153  0  [CR0805]
R154  0  [CR0805]
R155  0  [CR0805]
R156  0  [CR0805]
R175  10K  [CR0805]
R210  0  [CR0805]
R211  75  [CR0805]
R212  0  [CR0805]
R213  75  [CR0805]
R231  75  [CR0805]
R232  75  [CR0805]
R233  75  [CR0805]
R234  75  [CR0805]
RP1  103*4  [R4]
RP2  472*4  [R4]
RP3  472*4  [R4]
RP4  472*4  [R4]
RP11  10*4  [R4]
RP12  10*4  [R4]
RP14  472*4  [R4]
RP27  472*4  [R4]
RP28  472*4  [R4]
RP30  472*4  [R4]
TP6  TP  [TP]  (value not drawn)
TP14  TP  [TP]  (value not drawn)
TP15  TP  [TP]  (value not drawn)
TP20  TP  [TP]  (value not drawn)
TP21  TP  [TP]  (value not drawn)
TP22  TP  [TP]  (value not drawn)
TP23  TP  [TP]  (value not drawn)
TP24  TP  [TP]  (value not drawn)
TP25  TP  [TP]  (value not drawn)
TP26  TP  [TP]  (value not drawn)
TP27  TP  [TP]  (value not drawn)
TP141  (no value)  [TP]
TP142  (no value)  [TP]
U1  TJA1042T+118  [SO-8]
U2  TJA1042T+118  [SO-8]
U6  IMP706ESA/T  [SO-8]
U7  M41T00  [SO-8]
U8  AT24C02  [SO-8]
U10  MC9S12XHZ256  [LQFP-144]
U11  TC1047A  [SOT23]
U13  DSO751S  [SMD-CYC]
U21  FMS6143  [SO-8]
YC2  32.768KHz  [SM CYC NX3215SA]

### Ports
AD12-0 (in), AD12-1 (in), AD12-2 (in), ADC0 (in), ADC1 (in), ADC2 (in), ADC3 (in), AN-12V (out), AN-POW_1 (out), AN-POW_2 (out), CAN0_H (bidir), CAN0_L (bidir), CAN1_H (bidir), CAN1_L (bidir), CAN_SHLD0 (out), CAN_SHLD1 (out), CP1 (in), CP2 (in), DA1 (out), DA2 (out), DA3 (out), DA4 (out), DB1 (out), DB2 (out), DB3 (out), DB4 (out), DC1 (out), DC2 (out), DC3 (out), DC4 (out), DSEL (out), IN1 (out), IN2 (out), IS9 (in), LED1 (out), LED2 (out), LED3 (out), LED4 (out), LED5 (out), LED6 (out), LED7 (out), LED16 (out), LED17 (out), LED18 (out), LED19 (out), LED20 (out), LED21 (out), LED22 (out), LED23 (out), LED_BK (out), METER1_1 (out), METER1_2 (out), METER1_3 (out), METER1_4 (out), METER2_1 (out), METER2_2 (out), METER2_3 (out), METER2_4 (out), music (out), PWM1 (out), PWM2 (out), SP-PWM (out), SW101 (in), SW102 (in), SW103 (in), SW104 (in), SW105 (in), SW106 (in), V-5V (out), V-POW1 (out), V-POW2 (out), V-POW (out)

### Nets
+5V-VT: J2.20 J2.21 J2.22 L201.1 L205.1
+5VM: C10.1 C12.1 C21.2 C25.1 C36.1 C37.1 C39.2 C56.1 C57.1 C80.1 CP2.1 CP3.1 CP6.1 CP11.1 CP12.1 CP16.1 CP17.1 CP18.1 CP22.1 CP23.1 CP24.1 CP25.1 CP26.1 J1.4 R33.2 R58.1 R142.2 RP2.1 RP2.2 RP2.3 RP2.4 RP3.5 RP3.6 RP3.7 RP3.8 RP4.1 RP4.2 RP4.3 RP4.4 RP14.1 RP14.2 RP14.3 RP14.4 RP27.1 RP27.2 RP27.3 RP27.4 RP28.1 RP28.2 RP28.3 RP28.4 RP30.1 RP30.2 RP30.3 RP30.4 U1.3(Vcc) U2.3(Vcc) U6.2(VCC) U7.8(Vcc) U8.8(VCC) U10.9(VDDM1) U10.19(VDDM2) U10.29(VDDM3) U10.50(VDDR) U10.51(VDDX2) U10.78(VRH) U10.79(VDDA) U10.98(VLCD) U10.131(VDDX1) U11.1(E) U13.4(Vd)
+5VV: D201.2 D202.2 L201.2
+12V-1: JV01.4 JV02.4
GND: BT1.2(-) C3.2 C4.2 C5.1 C6.1 C7.2 C8.2 C9.1 C10.2 C11.1 C12.2 C21.1 C25.2 C34.2 C36.2 C37.2 C39.1 C56.2 C57.2 C80.2 C98.2 C208.2 CP2.2 CP3.2 CP6.2 CP11.2 CP12.2 CP13.1 CP13.2 CP13.3 CP13.4 CP14.1 CP14.2 CP14.3 CP14.4 CP16.2 CP17.2 CP18.2 CP22.2 CP23.2 CP24.2 CP25.2 CP26.2 CP200.2 D25.1 D32.1 D39.1 D40.1 D201.1 D202.1 DZ6.2 J1.6 J2.1 J2.10 J2.12 J2.14 J2.16 J2.18 J2.23 J2.24 JV01.1 JV01.3 JV02.1 JV02.3 R3.2 R4.2 R9.2 R10.2 R35.2 R37.2 R43.2 R139.1 R175.2 R211.2 R213.2 R231.2 R232.2 RP1.5 RP1.6 RP1.7 RP1.8 U1.2(Gnd) U2.2(Gnd) U6.3(GND) U7.4(Vss) U8.1(A0) U8.2(A1) U8.3(A2) U8.4(GND) U8.7(WP) U10.10(VSSM1) U10.20(VSSM2) U10.30(VSSM3) U10.49(VSS2) U10.52(VSSX2) U10.57(VSSPLL) U10.60(TEST) U10.76(VSSA) U10.77(VRL) U10.97(VSS1) U10.132(VSSX1) U11.3(C) U13.2(GND) U21.5(GND)
AD12-0: U10.83(KWAD3/AD3) ; port AD12-0
AD12-1: U10.84(KWAD4/AD4) ; port AD12-1
AD12-2: U10.85(KWAD5/AD5) ; port AD12-2
ADC0: U10.4(AN15/PL7) ; port ADC0
ADC1: U10.1(AN12/PL4) ; port ADC1
ADC2: U10.81(KWAD1/AD1) ; port ADC2
ADC3: U10.82(KWAD2/AD2) ; port ADC3
AN-12V: U10.103(PB0/FP0) ; port AN-12V
AN-POW_1: U10.93(PD5/DATA5) ; port AN-POW_1
AN-POW_2: U10.92(PD4/DATA4) ; port AN-POW_2
BKGD: DZ6.4 DZ6.6 J1.1 R58.2 U10.53(MODC/BKGD)
CAN0_H: C6.2 D32.2 R5.2 U1.7(CH) ; port CAN0_H
CAN0_L: C11.2 D25.2 R5.1 U1.6(CL) ; port CAN0_L
CAN1_H: C5.2 D40.2 R6.2 U2.7(CH) ; port CAN1_H
CAN1_L: C9.2 D39.2 R6.1 U2.6(CL) ; port CAN1_L
CAN_SHLD0: R12.2 ; port CAN_SHLD0
CAN_SHLD1: R13.2 ; port CAN_SHLD1
CANRX0: U1.4(R) U10.63(RXCAN0/PM2)
CANRX1: U2.4(R) U10.65(RXCAN1/PM4)
CANTX0: U1.1(D) U10.64(TXCAN0/PM3)
CANTX1: U2.1(D) U10.66(TXCAN1/PM5)
CP1: U10.139(PT2/IOC2) ; port CP1
CP2: U10.138(PT1/IOC1) ; port CP2
DA1: U10.134(PC5/DAT13) ; port DA1
DA2: U10.108(PB5/FP5) ; port DA2
DA3: U10.48(TXD1/PS3) ; port DA3
DA4: U10.99(PK3/BP3) ; port DA4
DB1: U10.135(PC6/DAT14) ; port DB1
DB2: U10.107(PB4/FP4) ; port DB2
DB3: U10.47(RXD1/PS2) ; port DB3
DB4: U10.95(PD7/DATA7) ; port DB4
DC1: U10.136(PC7/DAT15) ; port DC1
DC2: U10.106(PB3/FP3) ; port DC2
DC3: U10.46(TXD0/PS1) ; port DC3
DC4: U10.94(PD6/DATA6) ; port DC4
download: R156.2 U10.89(PD1/DATA1)
DSEL: U10.44(ACC1/PK5) ; port DSEL
IN1: U10.45(RXD0/PS0) ; port IN1
IN2: U10.43(ACC0/PK4) ; port IN2
IS9: U10.3(AN14/PL6) ; port IS9
LCD-PWM: J2.19 TP6.1 U10.38(RXD1)
LED1: U10.13(M0C1M) ; port LED1
LED2: U10.14(M0C1P) ; port LED2
LED3: U10.12(M0C0P) ; port LED3
LED4: U10.11(M0C0M) ; port LED4
LED5: U10.144(PT7/OC7) ; port LED5
LED6: U10.143(PT6/IOC6) ; port LED6
LED7: U10.140(PT3/IOC3) ; port LED7
LED16: U10.100(PK2/BP2) ; port LED16
LED17: U10.27(M3C1M) ; port LED17
LED18: U10.23(M2C1M) ; port LED18
LED19: U10.24(M2C1P) ; port LED19
LED20: U10.25(M3C0M) ; port LED20
LED21: U10.26(M3C0P) ; port LED21
LED22: U10.28(M3C1P) ; port LED22
LED23: U10.137(PT0/IOC0) ; port LED23
LED_BK: U10.35(SCL0/PWM5) ; port LED_BK
MCU-CLK: R149.2 U10.70(SCK/PS6)
MCU-CS: R152.2 U10.71(~{SS}/PS7)
MCU-MISO: R138.2 U10.68(MISO/PS4)
MCU-MOSI: R148.2 U10.69(MOSI/PS5)
METER1_1: RP11.5 ; port METER1_1
METER1_2: RP11.6 ; port METER1_2
METER1_3: RP11.7 ; port METER1_3
METER1_4: RP11.8 ; port METER1_4
METER2_1: RP12.5 ; port METER2_1
METER2_2: RP12.6 ; port METER2_2
METER2_3: RP12.7 ; port METER2_3
METER2_4: RP12.8 ; port METER2_4
MODA: RP1.3 U10.67(MODA/PE5)
Mode_Ctrl: R153.2 U10.88(PD0/DATA0)
music: U10.36(SDA0/PWM4) ; port music
PWM1: U10.40(PWM1/PP1) ; port PWM1
PWM2: U10.42(SCL1/PWM7) ; port PWM2
RS0: R3.1 U1.8(Rs) U10.62(~{CS1}/PM1)
RS1: R4.1 U2.8(Rs) U10.74(PE4/ECLK)
RST: DZ6.1 DZ6.3 J1.5 R34.2 U10.54(~{RESET})
SCL: RP3.3 U7.6(SCL) U8.6(SCL) U10.104(PB1/FP1)
SCL_TW8835: R154.2 U10.142(PT5/IOC5)
SDA: RP3.4 U7.5(SDA) U8.5(SDA) U10.105(PB2/FP2)
SDA_TW8835: R155.2 U10.141(PT4/IOC4)
SP-PWM: U10.37(PWM3) ; port SP-PWM
SPLIT: C3.1 U1.5(Vref)
SW101: U10.22(M2C0P) ; port SW101
SW102: U10.21(M2C0M) ; port SW102
SW103: U10.18(M1C1P) ; port SW103
SW104: U10.17(M1C1M) ; port SW104
SW105: U10.16(M1C0P) ; port SW105
SW106: U10.15(M1C0M) ; port SW106
TV1: C201.2 U21.1(IN1)
TV2: C202.2 U21.2(IN2)
V-5V: U10.91(PD3/DATA3) ; port V-5V
V-POW: U10.90(PD2/DATA2) ; port V-POW
V-POW1: U10.101(PK1/BP1) ; port V-POW1
V-POW2: U10.102(PK0/BP0) ; port V-POW2
WDI: R37.1 U6.6(WDI) U10.61(ACC2/PK6)
YIN1: C205.2 J2.11 TP14.1
YIN2: C206.2 J2.13 TP15.1
NetBT1_1: BT1.1(+) U7.3(VBAT)
NetC4_1: C4.1 U2.5(Vref)
NetC7_1: C7.1 R12.1
NetC8_1: C8.1 R13.1
NetC34_1: C34.1 U10.96(VDD1)
NetC48_1: C48.1 R54.1 U10.56(XFC)
NetC48_2: C48.2 C52.1 U10.55(VDDPLL)
NetC52_2: C52.2 C98.1 R54.2
NetC201_1: C201.1 R210.2 R211.1
NetC202_1: C202.1 R212.2 R213.1
NetC205_1: C205.1 R232.1 R233.1
NetC206_1: C206.1 R231.1 R234.2
NetC208_1: C208.1 CP200.1 L205.2 U21.4(VCC)
NetCP13_5: CP13.5 RP11.4 U10.31(M5C0M)
NetCP13_6: CP13.6 RP11.3 U10.32(M5C0P)
NetCP13_7: CP13.7 RP11.2 U10.33(M5C1M)
NetCP13_8: CP13.8 RP11.1 U10.34(M5C1P)
NetCP14_5: CP14.5 RP12.4 U10.5(M4C0M)
NetCP14_6: CP14.6 RP12.3 U10.6(M4C0P)
NetCP14_7: CP14.7 RP12.2 U10.7(M4C1M)
NetCP14_8: CP14.8 RP12.1 U10.8(M4C1P)
NetD201_3: D201.3 JV01.2 R210.1 TP141.1
NetD202_3: D202.3 JV02.2 R212.1 TP142.1
NetJ2_2: J2.2 R138.1 TP20.1
NetJ2_3: J2.3 R148.1 TP21.1
NetJ2_4: J2.4 R149.1 TP22.1
NetJ2_5: J2.5 R152.1 TP23.1
NetJ2_6: J2.6 R153.1 TP24.1
NetJ2_7: J2.7 R154.1 TP25.1
NetJ2_8: J2.8 R155.1 TP26.1
NetJ2_9: J2.9 R156.1 TP27.1
NetR9_1: R9.1 U10.87(KWAD7/AD7)
NetR10_1: R10.1 U10.86(KWAD6/AD6)
NetR33_1: R33.1 U6.1(~{MR}) U6.8(~{WDO})
NetR34_1: R34.1 U6.7(~{REST})
NetR35_1: R35.1 U6.4(PFI)
NetR43_1: R43.1 U10.41(SDA1/PWM6)
NetR53_1: R53.1 U13.3(OUT)
NetR53_2: R53.2 U10.58(EXTAL)
NetR139_2: R139.2 U10.2(AN13/PL5)
NetR142_1: R142.1 U10.72(~{IRQ}/PE1)
NetR175_1: R175.1 U10.39(TXD1/PWM0)
NetR233_2: R233.2 U21.8(OUT1)
NetR234_1: R234.1 U21.7(OUT2)
NetRP1_1: RP1.1 U10.75(PE0/~{XIRQ})
NetRP1_2: RP1.2 U10.73(PE6/MODB)
NetRP2_5: RP2.5 U10.112(PA1/FP9)
NetRP2_6: RP2.6 U10.111(PA0/FP8)
NetRP2_7: RP2.7 U10.110(PB7/FP7)
NetRP2_8: RP2.8 U10.109(PB6/FP6)
NetRP3_2: RP3.2 U7.7(TRQ)
NetRP4_5: RP4.5 U10.116(PA5/FP13)
NetRP4_6: RP4.6 U10.115(PA4/FP12)
NetRP4_7: RP4.7 U10.114(PA3/FP11)
NetRP4_8: RP4.8 U10.113(PA2/FP10)
NetRP14_5: RP14.5 U10.133(PC4/DAT12)
NetRP14_7: RP14.7 U10.130(PK7/~{EWAIT}/ROMCTL)
NetRP14_8: RP14.8 U10.129(PE7/ECLKX2/XCLKS)
NetRP27_5: RP27.5 U10.128(PE3/~{LSTRB}/LDS)
NetRP27_6: RP27.6 U10.127(PE2/R/~{W})
NetRP27_7: RP27.7 U10.126(PC3/DAT11)
NetRP27_8: RP27.8 U10.125(PC2/DAT10)
NetRP28_5: RP28.5 U10.120(PL1/FP17)
NetRP28_6: RP28.6 U10.119(PL0/FP16)
NetRP28_7: RP28.7 U10.118(PA7/FP15)
NetRP28_8: RP28.8 U10.117(PA6/FP14)
NetRP30_5: RP30.5 U10.124(PC1/DAT9)
NetRP30_6: RP30.6 U10.123(PC0/DAT8)
NetRP30_7: RP30.7 U10.122(PL3/FP19)
NetRP30_8: RP30.8 U10.121(PL2/FP18)
NetU7_1: U7.1(XI) YC2.2
NetU7_2: U7.2(XO) YC2.1
NetU10_80: U10.80(KWAD0/AD0) U11.2(B)

Not connected (* = marked no-connect by the designer): DZ6 5; J1 2 3; J2 15 17; RP1 4; RP3 1; RP14 6; U6 5(~{PFO})*; U10 59(XTAL)*; U13 1(OE)*; U21 3(IN3) 6(OUT3)

### Notes on the sheet
- 2
- 3
- (near RP14) 4
- (near U7) 时钟及EEROM
- 4
- (near CP14) 3
- (near CP14) 4
- (near C34) 2
- (near C34) 4
- (near CP18) 4
- (near RP12) 2
- (near C7) 4
- (near CP13) 2
- (near CP13) 3
- (near R10) 2
- (near RP11) 2
- (near RP11) 3
- CAN通讯模块电路
- (near R43) 3
- 01 Mcu
- (near L201) 视频输入及接口电路
- SCH-ZB206B-0B
- 2016.08.02
- 1
- 5
- 叶天宝
- Title
- Version:
- File:
- Date:
- Sheet
- of
- Design By:
- Check By:
- Pass By:
- Co.
- 汉纳森（厦门）数据股份有限公司
- Size
- A3
- (in symbol CAPACITOR POL) +

### Library data of the parts
BT1 = BATTERY
C3-C12 C21 C25 C34 C36 C37 C39 C48 C52 C56 C57 C80 C98 C208 = CAP: Capacitor
C201 C202 C205 C206 = CAP: 贴片电容
CP2 CP3 CP6 CP11 CP12 CP16-CP18 CP22-CP26 CP200 = CAPACITOR POL: Capacitor
CP13 CP14 = RC_ARRAY
D25 D32 D39 D40 = TVS
D201 D202 = BAV23S: 双二极管
DZ6 = BZA456G: 二极管排
J1 = CON6: Connector
JV01 JV02 = CON4: Connector
R3-R6 R9 R10 R12 R13 R33-R35 R37 R43 R53 R54 R58 R139 R142 R175 R210-R213 R231-R234 = RES: 贴片电阻
R138 R148 R149 R152-R156 = Resister mini: 贴片电阻
RP1 RP2 RP4 RP14 RP27 RP28 RP30 = R_LINE4: 贴片排阻
RP3 = R_ARRAY
RP11 RP12 = R_PAI
TP141 TP142 = TP
U1 U2 = SN65HVD251
U6 = IMP706
U7 = M41T00: IC
U8 = AT24C02: IC
U11 = DTC143
U13 = POW_CRY
U21 = FMS6143: IC-视频滤波
YC2 = CRYSTAL0

## Nets that join several sheets
+5VM: 04 Switch (8 pins), 01 Mcu (71 pins)
GND: 04 Switch (100 pins), 01 Mcu (104 pins)
ADC0: 04 Switch (U17.3), 01 Mcu (U10.4)
ADC1: 04 Switch (U18.3), 01 Mcu (U10.1)
ADC2: 04 Switch (U20.3), 01 Mcu (U10.81)
ADC3: 04 Switch (U5.3), 01 Mcu (U10.82)
AN-POW_1: 04 Switch (D33.1), 01 Mcu (U10.93)
AN-POW_2: 04 Switch (D21.1), 01 Mcu (U10.92)
CAN0_H: 04 Switch (JA1.7), 01 Mcu (C6.2 D32.2 R5.2 U1.7)
CAN0_L: 04 Switch (JA1.5 R66.1), 01 Mcu (C11.2 D25.2 R5.1 U1.6)
CAN1_H: 04 Switch (JA1.8), 01 Mcu (C5.2 D40.2 R6.2 U2.7)
CAN1_L: 04 Switch (JA1.6 R151.2), 01 Mcu (C9.2 D39.2 R6.1 U2.6)
CAN_SHLD0: 04 Switch (JA1.9), 01 Mcu (R12.2)
CAN_SHLD1: 04 Switch (JA1.10), 01 Mcu (R13.2)
DA1: 04 Switch (U17.11), 01 Mcu (U10.134)
DA2: 04 Switch (U18.11), 01 Mcu (U10.108)
DA3: 04 Switch (U20.11), 01 Mcu (U10.48)
DA4: 04 Switch (U5.11), 01 Mcu (U10.99)
DB1: 04 Switch (U17.10), 01 Mcu (U10.135)
DB2: 04 Switch (U18.10), 01 Mcu (U10.107)
DB3: 04 Switch (U20.10), 01 Mcu (U10.47)
DB4: 04 Switch (U5.10), 01 Mcu (U10.95)
DC1: 04 Switch (U17.9), 01 Mcu (U10.136)
DC2: 04 Switch (U18.9), 01 Mcu (U10.106)
DC3: 04 Switch (U20.9), 01 Mcu (U10.46)
DC4: 04 Switch (U5.9), 01 Mcu (U10.94)
V-POW: 04 Switch (D12.1), 01 Mcu (U10.90)